# EAGLE design keyboard (EAGLE 7.5.0)
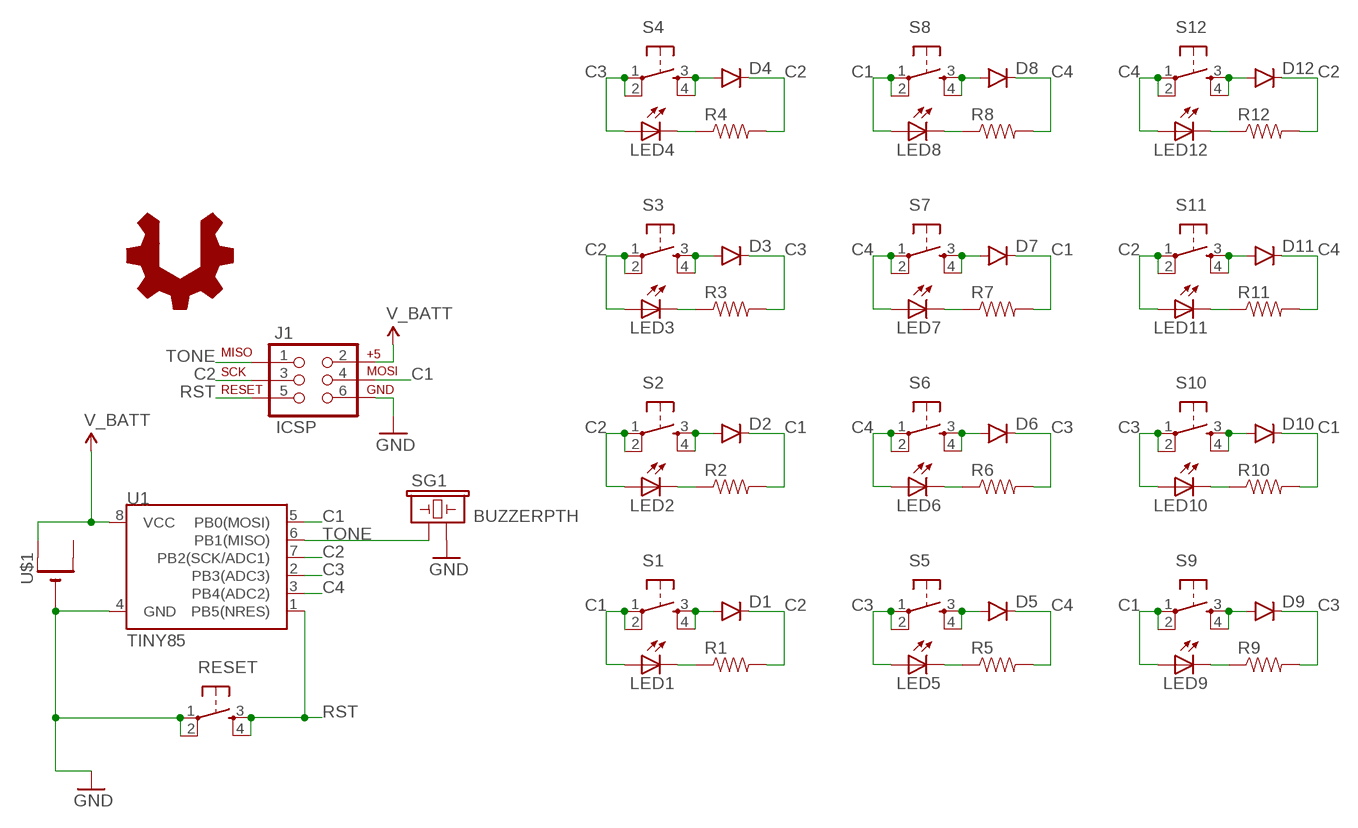
[diagram p0: schematic, sheet 1]

## Parts
D1  DIODE1N4148  [DIODE-1N4148]
D2  DIODE1N4148  [DIODE-1N4148]
D3  DIODE1N4148  [DIODE-1N4148]
D4  DIODE1N4148  [DIODE-1N4148]
D5  DIODE1N4148  [DIODE-1N4148]
D6  DIODE1N4148  [DIODE-1N4148]
D7  DIODE1N4148  [DIODE-1N4148]
D8  DIODE1N4148  [DIODE-1N4148]
D9  DIODE1N4148  [DIODE-1N4148]
D10  DIODE1N4148  [DIODE-1N4148]
D11  DIODE1N4148  [DIODE-1N4148]
D12  DIODE1N4148  [DIODE-1N4148]
J1  ICSP  AVR_SPI_PRG_6LABELED  [2X3-NS]
LED1  LED5MM  [LED5MM]
LED2  LED5MM  [LED5MM]
LED3  LED5MM  [LED5MM]
LED4  LED5MM  [LED5MM]
LED5  LED5MM  [LED5MM]
LED6  LED5MM  [LED5MM]
LED7  LED5MM  [LED5MM]
LED8  LED5MM  [LED5MM]
LED9  LED5MM  [LED5MM]
LED10  LED5MM  [LED5MM]
LED11  LED5MM  [LED5MM]
LED12  LED5MM  [LED5MM]
R1  RESISTORAXIAL-0.3  [AXIAL-0.3]
R2  RESISTORAXIAL-0.3  [AXIAL-0.3]
R3  RESISTORAXIAL-0.3  [AXIAL-0.3]
R4  RESISTORAXIAL-0.3  [AXIAL-0.3]
R5  RESISTORAXIAL-0.3  [AXIAL-0.3]
R6  RESISTORAXIAL-0.3  [AXIAL-0.3]
R7  RESISTORAXIAL-0.3  [AXIAL-0.3]
R8  RESISTORAXIAL-0.3  [AXIAL-0.3]
R9  RESISTORAXIAL-0.3  [AXIAL-0.3]
R10  RESISTORAXIAL-0.3  [AXIAL-0.3]
R11  RESISTORAXIAL-0.3  [AXIAL-0.3]
R12  RESISTORAXIAL-0.3  [AXIAL-0.3]
RESET  TAC_SWITCHPTH  [TACTILE-PTH]
S1  TAC_SWITCHPTH  [TACTILE-PTH]
S2  TAC_SWITCHPTH  [TACTILE-PTH]
S3  TAC_SWITCHPTH  [TACTILE-PTH]
S4  TAC_SWITCHPTH  [TACTILE-PTH]
S5  TAC_SWITCHPTH  [TACTILE-PTH]
S6  TAC_SWITCHPTH  [TACTILE-PTH]
S7  TAC_SWITCHPTH  [TACTILE-PTH]
S8  TAC_SWITCHPTH  [TACTILE-PTH]
S9  TAC_SWITCHPTH  [TACTILE-PTH]
S10  TAC_SWITCHPTH  [TACTILE-PTH]
S11  TAC_SWITCHPTH  [TACTILE-PTH]
S12  TAC_SWITCHPTH  [TACTILE-PTH]
SG1  BUZZERPTH  [BUZZER-12MM]
U1  TINY85  ATTINY45TINY85-20-DIP  [DIP08]
U$1  CR2032THM  [CR2032-THRU]
U$2  USER_HACKABLE  [USER_HACKABLE]

## Nets
C1: D2.C D7.C D10.C J1.4(MOSI) LED1.A LED8.A LED9.A R2.P$2 R7.P$2 R10.P$2 S1.1 S1.2 S8.1 S8.2 S9.1 S9.2 U1.5(PB0(MOSI))
C2: D1.C D4.C D12.C J1.3(SCK) LED2.A LED3.A LED11.A R1.P$2 R4.P$2 R12.P$2 S2.1 S2.2 S3.1 S3.2 S11.1 S11.2 U1.7(PB2(SCK/ADC1))
C3: D3.C D6.C D9.C LED4.A LED5.A LED10.A R3.P$2 R6.P$2 R9.P$2 S4.1 S4.2 S5.1 S5.2 S10.1 S10.2 U1.2(PB3(ADC3))
C4: D5.C D8.C D11.C LED6.A LED7.A LED12.A R5.P$2 R8.P$2 R11.P$2 S6.1 S6.2 S7.1 S7.2 S12.1 S12.2 U1.3(PB4(ADC2))
GND: J1.6(GND) RESET.1 RESET.2 SG1.- U1.4(GND) U$1.-
N$1: LED1.K(C) R1.P$1
N$2: D1.A S1.3 S1.4
N$5: LED2.K(C) R2.P$1
N$6: D2.A S2.3 S2.4
N$9: LED3.K(C) R3.P$1
N$10: D3.A S3.3 S3.4
N$13: LED4.K(C) R4.P$1
N$14: D4.A S4.3 S4.4
N$17: LED5.K(C) R5.P$1
N$18: D5.A S5.3 S5.4
N$21: LED6.K(C) R6.P$1
N$22: D6.A S6.3 S6.4
N$25: LED7.K(C) R7.P$1
N$26: D7.A S7.3 S7.4
N$29: LED8.K(C) R8.P$1
N$30: D8.A S8.3 S8.4
N$33: LED9.K(C) R9.P$1
N$34: D9.A S9.3 S9.4
N$37: LED10.K(C) R10.P$1
N$38: D10.A S10.3 S10.4
N$41: LED11.K(C) R11.P$1
N$42: D11.A S11.3 S11.4
N$45: LED12.K(C) R12.P$1
N$46: D12.A S12.3 S12.4
RST: J1.5(RST) RESET.3 RESET.4 U1.1(PB5(NRES))
TONE: J1.1(MISO) SG1.+ U1.6(PB1(MISO))
V_BATT: J1.2(V+) U1.8(VCC) U$1.+1(+)
Unconnected: U$1.+2(+1)

## Library data of the parts
D1-D12 = SparkFun-DiscreteSemi:DIODE: Diode These are standard reverse protection diodes and small signal diodes. SMA package can handle up to about 1A. SOD-323 can handle about 200mA. What the SOD-323 package when ordering, there are some mfgs out there that are 5-pin packages.
J1 = barbary_enterprises:AVR_SPI_PRG_6: AVR ISP 6 Pin This is the reduced ISP connector for AVR programming. Common on Arduino. This footprint will take up less PCB space and can be used with a 10-pin to 6-pin adapter such as SKU: BOB-08508
LED1-LED12 = barbary_enterprises:LED: LEDs Standard schematic elements and footprints for 5mm, 3mm, 1206, and 0603 sized LEDs. 5mm - Spark Fun Electronics SKU : COM-00529 (and others)
R1-R12 = barbary_enterprises:RESISTOR: Resistor Basic schematic elements and footprints for 0603, 1206, and PTH resistors.
RESET S1-S12 = barbary_enterprises:TAC_SWITCH: Momentary Switch Button commonly used for reset or general input. Spark Fun Electronics SKU : COM-00097 SMT- SWCH-08247
SG1 = SparkFun-Electromechanical:BUZZER: Buzzer 12mm Spark Fun Electronics SKU : Comp-Buzzer
U1 = AtmelAvr:ATTINY45: Atmel 8-pin 2/4/8kB flash uC; PROD_ID: IC-09445; VALUE: TINY85-20-DIP
U$1 = battery:CR2032
U$2 = logo:USER_HACKABLE

## Board
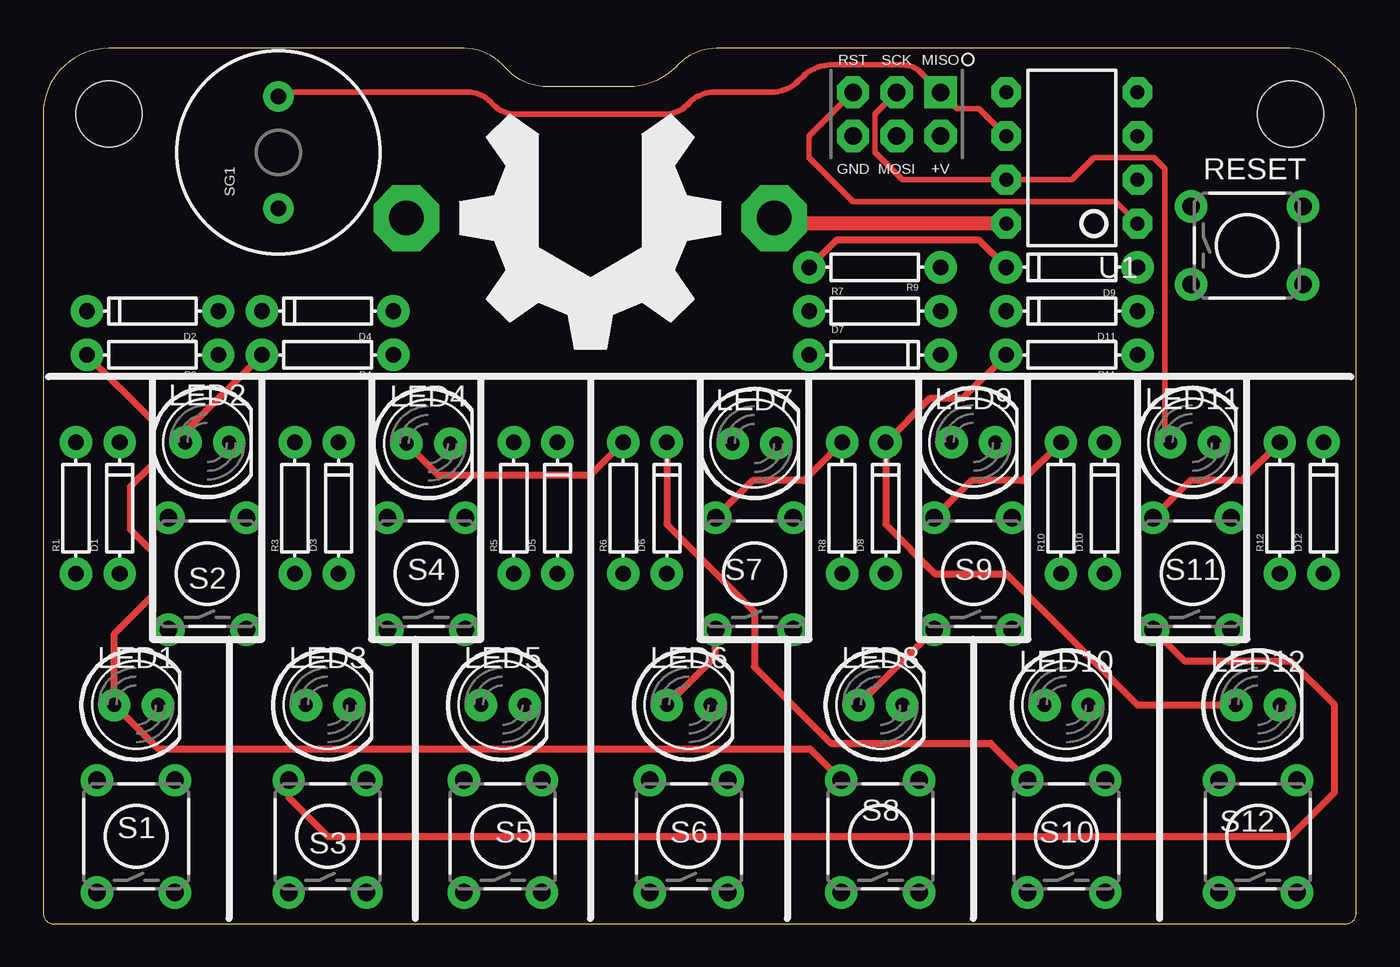
[diagram p1: board, top side]
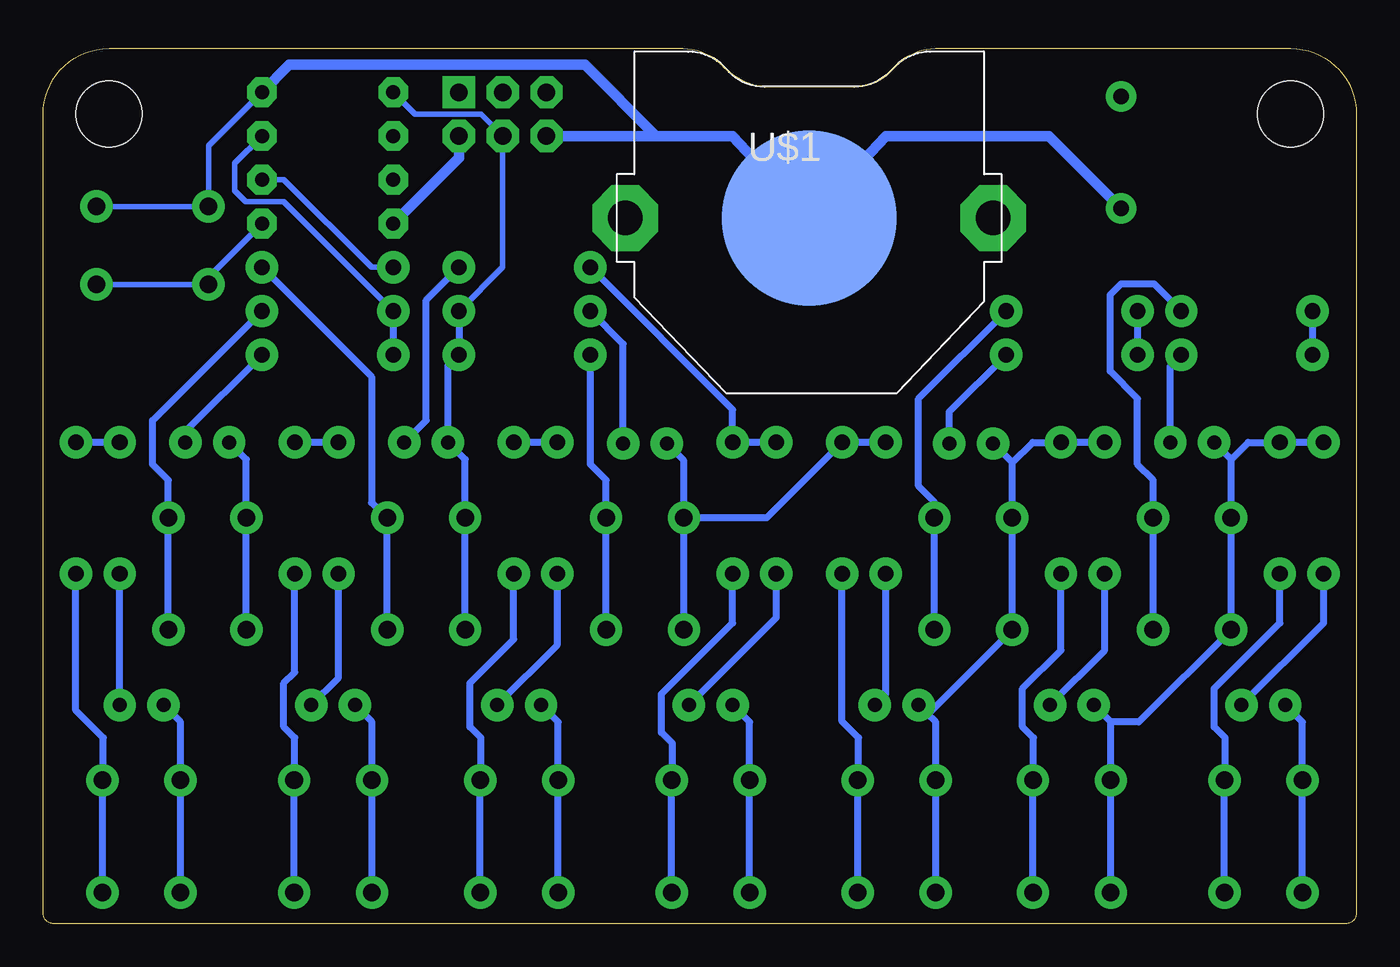
[diagram p2: board, bottom side, seen from below]

Size 76.2 x 50.8 mm. Coordinates in mm from the lower left corner, seen from the top.
Outline: 72.38,50.8 39.08,50.8 arc45 36.86,49.88 36.68,49.7 arc-45 33.98,48.58 29.24,48.58 arc-45 27.02,49.5 26.64,49.88 arc45 24.42,50.8 3.81,50.8 arc90 0,46.99 0,0.64 arc90 0.64,0 75.56,0 arc90 76.2,0.64 76.2,46.98 arc90 72.38,50.8
Copper layers (1*16): Top 0.0356mm / dielectric 1.5011mm / Bottom 0.0356mm
Design rules "LaenPCBOrder": minimum track width 6mil, minimum drill 13mil, track to track 6mil, track to pad 6mil, pad to pad 6mil, via to via 6mil, smd to smd 6mil, copper to edge 15mil, drill to drill 6mil, minimum pad ring 7mil, minimum via ring 7mil, stop-mask expansion 3mil, vias tented up to drill 0mil, thermal gap 10mil
Holes 3.81 mm at 3.81,46.99 72.39,46.99

### Footprints (pad centres in the part's own frame; a part is rotated, then mirrored left to right if it is on the bottom)
DIODE-1N4148 = drill 0.9 pad 1.88: A -3.81,0; C 3.81,0
2X3-NS = drill 1.016 pad 1.88 square: 1 -2.54,-1.27 | drill 1.016 pad 1.88 octagon: 2 -2.54,1.27; 3 0,-1.27; 4 0,1.27; 5 2.54,-1.27; 6 2.54,1.27
LED5MM = drill 0.813 pad 1.88: A -1.27,0; K 1.27,0
AXIAL-0.3 = drill 0.9 pad 1.88: P$1 -3.81,0; P$2 3.81,0
TACTILE-PTH = drill 1.016 pad 1.88: 1 -3.251,2.261; 2 3.251,2.261; 3 -3.251,-2.261; 4 3.251,-2.261
BUZZER-12MM = drill 0.9 pad 1.778: + 3.25,0; - -3.25,0
DIP08 = drill 0.813 pad 1.727 octagon: 1 -3.81,-3.81; 2 -1.27,-3.81; 3 1.27,-3.81; 4 3.81,-3.81; 5 3.81,3.81; 6 1.27,3.81; 7 -1.27,3.81; 8 -3.81,3.81
CR2032-THRU = drill 2 pad 3.81 octagon: +1 -10.668,0; +2 10.668,0 | smd 10.16 x 10.16: - 0,0

### Placement (x,y rotation side)
D1  4.45,24.13 90 top
D2  6.35,35.56 180 top
D3  17.14,24.13 90 top
D4  16.51,35.56 180 top
D5  29.84,24.13 90 top
D6  36.2,24.13 90 top
D7  48.26,33.02 0 top
D8  48.9,24.13 90 top
D9  59.69,38.1 180 top
D10  61.59,24.13 90 top
D11  59.69,35.56 180 top
D12  74.3,24.13 90 top
J1  49.53,46.99 180 top
LED1  5.4,12.7 0 top
LED2  9.53,27.94 0 top
LED3  16.51,12.7 0 top
LED4  22.35,27.88 0 top
LED5  26.67,12.7 0 top
LED6  37.47,12.7 0 top
LED7  41.27,27.88 0 top
LED8  48.58,12.7 0 top
LED9  53.98,27.94 0 top
LED10  59.37,12.7 0 top
LED11  66.67,27.94 0 top
LED12  70.48,12.7 0 top
R1  1.91,24.13 90 top
R2  6.35,33.02 180 top
R3  14.61,24.13 90 top
R4  16.51,33.02 180 top
R5  27.3,24.13 90 top
R6  33.66,24.13 90 top
R7  48.26,35.56 0 top
R8  46.35,24.13 90 top
R9  48.26,38.1 180 top
R10  59.05,24.13 90 top
R11  59.69,33.02 180 top
R12  71.75,24.13 90 top
RESET  69.85,39.37 0 top
S1  5.4,5.08 90 top
S2  9.53,20.32 90 top
S3  16.51,5.08 90 top
S4  22.23,20.32 90 top
S5  26.67,5.08 90 top
S6  37.47,5.08 90 top
S7  41.27,20.32 90 top
S8  48.58,5.08 90 top
S9  53.98,20.32 90 top
S10  59.37,5.08 90 top
S11  66.67,20.32 90 top
S12  70.48,5.08 90 top
SG1  13.65,44.77 90 top
U1  59.69,44.45 90 top
U$1  31.75,40.96 0 bottom
U$2  31.75,40.96 0 top

### Tracks (layer width: path | path; a pad name or v marks a point on that pad's centre or on a via)
C1
  Top 0.406: LED8.A 51.68,17.07 S9.1 | R10.P$2 56.83,25.72 53.86,25.72 S9.2 | R2.P$2 6.35,29.21 6.35,26.67 5.08,25.4 5.08,22.86 6.35,21.59 6.35,19.05 4.13,16.83 LED1.A 6.67,10.16 44.49,10.16 S8.2
  Bottom 0.305: U1.5 54.61,46.99 50.8,46.99 J1.4 49.53,38.1 R7.P$2
  Bottom 0.406: S1.1 S1.2 3.14,11.71 LED1.A | S8.1 S8.2 46.32,11.71 LED8.A | S9.1 S9.2 51.71,26.95 LED9.A 52.7,32.38 D7.C R7.P$2 | R10.P$2 D10.C | R2.P$2 D2.C
C2
  Top 0.305: J1.3 48.26,46.99 48.26,44.77 49.85,43.18 U1.7 59.69,43.18 60.96,44.45 64.45,44.45 65.09,43.81 65.09,28.26 LED11.A
  Top 0.406: R12.P$2 69.53,25.72 66.56,25.72 S11.2 | LED2.A 8.26,28.57 R4.P$2 | S3.2 14.25,7.34 16.51,5.08 72.39,5.08 74.93,7.62 74.93,12.7 72.39,15.24 66.24,15.24 S11.1
  Bottom 0.406: 14.25,11.71 S3.2 S3.1 | 14.25,11.71 LED3.A | 7.26,26.95 S2.2 S2.1 12.62,11.71 14.25,11.71 | 7.26,26.95 LED2.A | S11.1 S11.2 64.41,26.95 LED11.A | R1.P$2 D1.C 6.27,27.94 7.26,26.95 | R12.P$2 D12.C | D4.C R4.P$2
C3
  Top 0.406: LED4.A 22.92,26.04 31.75,26.04 R6.P$2 | D6.C 36.2,23.18 41.27,18.1 41.27,14.92 45.72,10.48 54.97,10.48 S10.2 | D9.C 54.29,39.69 46.04,39.69 R9.P$2
  Bottom 0.305: D9.C 57.15,38.1 62.23,43.18 U1.2
  Bottom 0.406: S5.1 S5.2 24.41,11.71 24.92,12.22 | S10.1 S10.2 57.11,11.71 LED10.A | 24.92,12.22 LED5.A | 19.96,26.76 S4.2 S4.1 24.81,12.22 24.92,12.22 | 19.96,26.76 LED4.A | R3.P$2 D3.C 18.78,27.94 19.96,26.76 | R6.P$2 D6.C 36.2,29.84 R9.P$2
C4
  Top 0.406: LED6.A 39.01,15.52 S7.1 | R8.P$2 44.13,25.72 41.16,25.72 S7.2 | LED12.A 63.5,12.7 55.88,20.32 51.75,20.32 48.9,23.18 D8.C 51.44,30.48 53.34,30.48 R11.P$2
  Bottom 0.305: D11.C 62.23,41.91 64.45,41.91 65.09,42.55 65.09,44.13 U1.3
  Bottom 0.406: S6.1 S6.2 35.2,11.71 LED6.A | S12.1 S12.2 68.22,11.71 LED12.A | S7.1 S7.2 | S7.2 39.01,26.89 LED7.A | R5.P$2 D5.C 34.21,23.57 S7.2 | R8.P$2 D8.C | D11.C R11.P$2
GND
  Bottom 0.305: RESET.2 RESET.1 66.6,45.16 U1.4
  Bottom 0.61: SG1.- 17.86,45.72 27.3,45.72 U$1.- 36.2,45.72 40.64,45.72 | J1.6 40.64,45.72 | U1.4 61.91,49.85 44.77,49.85 40.64,45.72
N$1
  Bottom 0.406: LED1.K 1.91,17.46 R1.P$1
N$2
  Bottom 0.406: S1.3 S1.4 7.62,8.37 7.62,10.79 8.26,11.43 8.26,13.65 4.45,17.46 D1.A
N$5
  Bottom 0.406: LED2.K 10.79,32.38 R2.P$1
N$6
  Bottom 0.406: S2.3 S2.4 11.79,25.76 12.7,26.67 12.7,30.48 14.29,32.07 14.29,36.51 13.65,37.15 11.75,37.15 D2.A
N$9
  Bottom 0.406: LED3.K 14.61,15.88 R3.P$1
N$10
  Bottom 0.406: S3.3 S3.4 18.73,8.37 18.73,10.79 19.37,11.43 19.37,13.65 17.14,15.88 D3.A
N$13
  Bottom 0.406: LED4.K 23.62,29.72 R4.P$1
N$14
  Bottom 0.406: S4.3 S4.4 24.49,24.49 25.4,25.4 25.4,30.48 D4.A
N$17
  Bottom 0.406: LED5.K 27.3,13.34 R5.P$1
N$18
  Bottom 0.406: S5.3 S5.4 28.89,8.37 28.89,10.79 29.84,11.75 D5.A
N$21
  Bottom 0.406: LED6.K 33.66,17.78 R6.P$1
N$22
  Bottom 0.406: S6.3 S6.4 39.69,8.37 39.69,10.48 40.32,11.11 40.32,13.34 36.2,17.46 D6.A
N$25
  Bottom 0.406: LED7.K 42.55,33.66 R7.P$1
N$26
  Bottom 0.406: S7.3 S7.4 43.54,25.76 44.45,26.67 D7.A
N$29
  Bottom 0.406: LED8.K 46.35,16.19 R8.P$1
N$30
  Bottom 0.406: S8.3 S8.4 50.8,8.37 50.8,10.79 51.44,11.43 51.44,13.97 48.9,16.51 D8.A
N$33
  Bottom 0.406: LED9.K 53.98,29.21 53.98,36.2 R9.P$1
N$34
  Bottom 0.406: S9.3 S9.4 56.27,23.57 57.15,24.45 57.15,31.75 D9.A
N$37
  Bottom 0.406: LED10.K 59.05,14.29 R10.P$1
N$38
  Bottom 0.406: S10.3 S10.4 61.59,8.37 61.59,10.79 62.23,11.43 62.23,13.97 61.59,14.61 D10.A
N$41
  Bottom 0.406: LED11.K 67.94,28.57 R11.P$1
N$42
  Bottom 0.406: S11.3 S11.4 68.94,25.76 69.85,26.67 69.85,29.21 D11.A
N$45
  Bottom 0.406: LED12.K R12.P$1
N$46
  Bottom 0.406: S12.3 S12.4 72.71,8.37 72.71,10.79 74.3,12.38 D12.A
RST
  Top 0.305: U1.1 62.23,41.91 46.99,41.91 44.45,44.45 44.45,45.72 J1.5
  Bottom 0.305: RESET.4 RESET.3 66.6,37.54 U1.1
TONE
  Top 0.305: U1.6 54.29,47.31 53.02,47.31 J1.1 50.88,49.45 arc45 49.92,49.85 45.7,49.85 arc45 44.11,49.19 43.84,48.92 arc-45 42.25,48.26 38.94,48.26 arc45 37.51,47.66 37.36,47.52 arc-45 36.09,46.99 27.41,46.99 arc-45 26.14,47.52 25.93,47.73 arc45 24.66,48.26 13.89,48.26 SG1.+
V_BATT
  Top 0.813: U1.8 43.18,40.64 U$1.+1
  Bottom 0.61: J1.2 52.07,44.45 U1.8